# Altium schematic sheet Waveshape_LFO_v1_Controls_SCH.SchDoc
size A
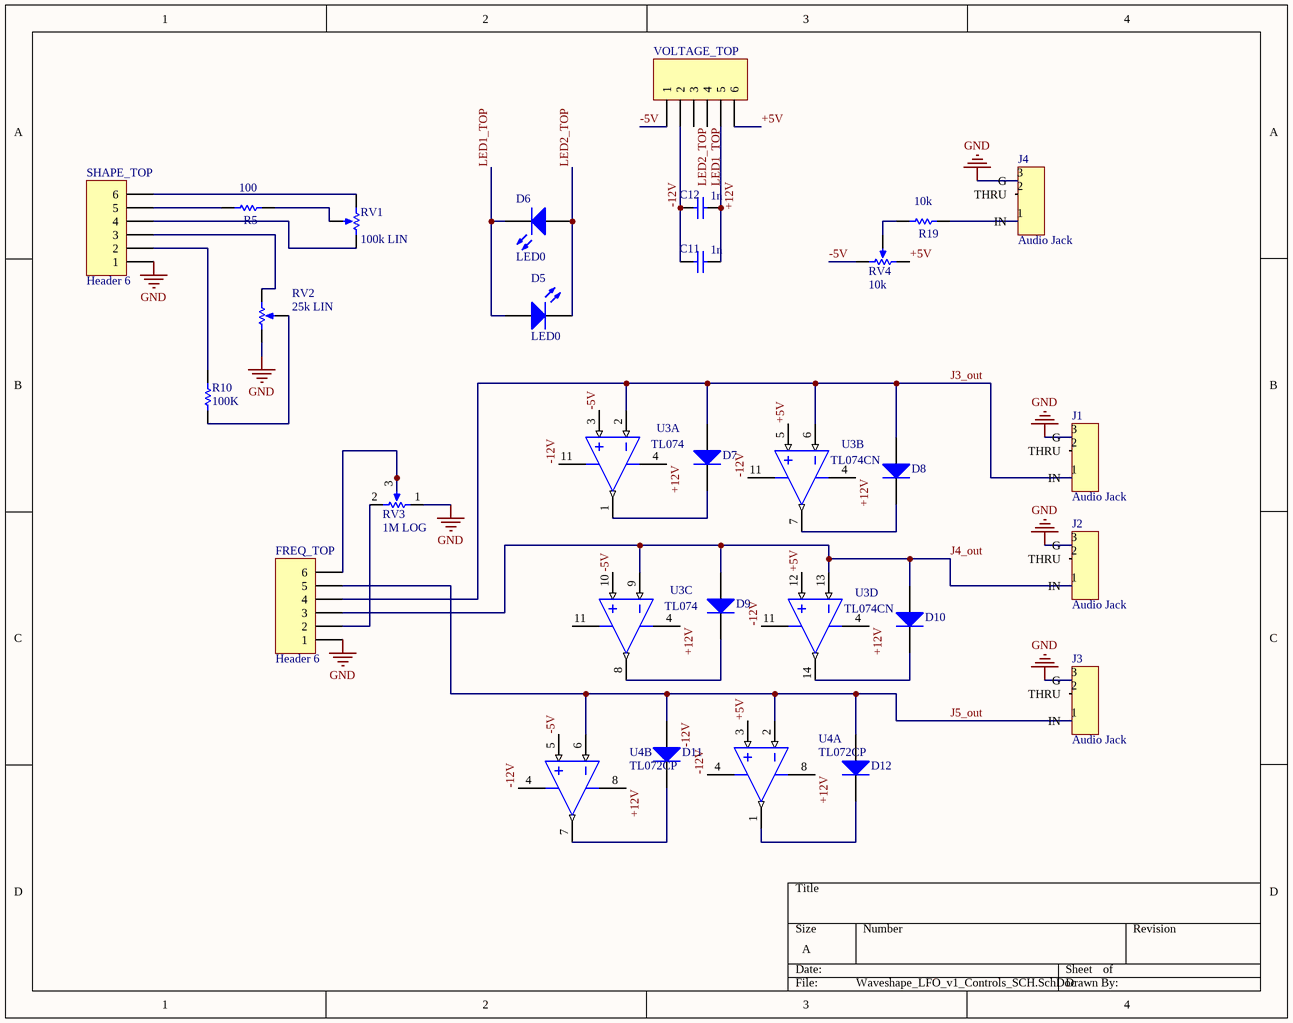
[diagram p0: Waveshape_LFO_v1_Controls_SCH.SchDoc]

## Parts
C11  value 1n  [RAD-0.3]  (hidden comment: Cap)
C12  value 1n  [RAD-0.3]  (hidden comment: Cap)
D5  LED0  [LED-1]
D6  LED0  [LED-1]
D7  Diode 1N4148  [DO-35]  (value not drawn)
D8  Diode 1N4148  [DO-35]  (value not drawn)
D9  Diode 1N4148  [DO-35]  (value not drawn)
D10  Diode 1N4148  [DO-35]  (value not drawn)
D11  Diode 1N4148  [DO-35]  (value not drawn)
D12  Diode 1N4148  [DO-35]  (value not drawn)
FREQ_TOP  Header 6  [HDR1X6]
J1  Audio Jack  [Audio Jack]
J2  Audio Jack  [Audio Jack]
J3  Audio Jack  [Audio Jack]
J4  Audio Jack  [Audio Jack]
R5  value 100  [AXIAL-0.3]
R10  value 100K  [AXIAL-0.3]
R19  value 10k  [AXIAL-0.3]
RV1  value 100k LIN  [VR5]  (hidden comment: RPot)
RV2  value 25k LIN  [VR5]  (hidden comment: j)
RV3  value 1M LOG  [VR5]  (hidden comment: RPot)
RV4  value 10k  [VR5]  (hidden comment: RPot)
SHAPE_TOP  Header 6  [HDR1X6]
U3  TL074  [N0014A]  (parts A,B,C,D of 4)
U4  TL072CP  [P0008A]  (parts A,B of 2)
VOLTAGE_TOP  Header 6  [HDR1X6]  (value not drawn)

## Nets
GND: FREQ_TOP.1 J1.3(G) J2.3(G) J3.3(G) J4.3(G) RV2.1(TOP) RV3.1(TOP) SHAPE_TOP.1
+5V: RV4.1(TOP) U3.5(IN2+) U3.12(IN4+) U4.3(IN1+) VOLTAGE_TOP.6
+12V: C11.2 C12.2 U3.4(VCC+) U4.8(VCC+) VOLTAGE_TOP.5
-5V: RV4.2(BOT) U3.3(IN1+) U3.10(IN3+) U4.5(IN2+) VOLTAGE_TOP.1
-12V: C11.1 C12.1 U3.11(VCC-) U4.4(VCC-) VOLTAGE_TOP.2
J3_out: D7.1(A) D8.1(A) FREQ_TOP.4 J1.1(IN) U3.2(IN1-) U3.6(IN2-)
J4_out: D9.1(A) D10.1(A) FREQ_TOP.3 J2.1(IN) U3.9(IN3-) U3.13(IN4-)
J5_out: D11.1(A) D12.1(A) FREQ_TOP.5 J3.1(IN) U4.2(IN1-) U4.6(IN2-)
LED1_TOP: D5.1(A) D6.2(K) VOLTAGE_TOP.4
LED2_TOP: D5.2(K) D6.1(A) VOLTAGE_TOP.3
NetD7_2: D7.2(K) U3.1(OUT1)
NetD8_2: D8.2(K) U3.7(OUT2)
NetD9_2: D9.2(K) U3.8(OUT3)
NetD10_2: D10.2(K) U3.14(OUT4)
NetD11_2: D11.2(K) U4.7(OUT2)
NetD12_2: D12.2(K) U4.1(OUT1)
NetFREQ_TOP_2: FREQ_TOP.2 RV3.2(BOT)
NetFREQ_TOP_6: FREQ_TOP.6 RV3.3(TAP)
NetJ4_1: J4.1(IN) R19.2
NetR5_1: R5.1 SHAPE_TOP.5
NetR5_2: R5.2 RV1.3(TAP)
NetR10_1: R10.1 RV2.3(TAP)
NetR10_2: R10.2 SHAPE_TOP.2
NetR19_1: R19.1 RV4.3(TAP)
NetRV1_1: RV1.1(TOP) SHAPE_TOP.6
NetRV1_2: RV1.2(BOT) SHAPE_TOP.4
NetRV2_2: RV2.2(BOT) SHAPE_TOP.3

Not connected (* = marked no-connect by the designer): J1 2(THRU); J2 2(THRU); J3 2(THRU); J4 2(THRU)

## Notes on the sheet
- Labels drawn without touching a wire or pin: -12V

## Library data of the parts
C11 C12 = Cap: Capacitor; Published: 8-Jun-2000; LatestRevisionDate: 17-Jul-2002; LatestRevisionNote: Re-released for DXP Platform.; PackageReference: RAD-0.3; Publisher: Altium Limited; PackageDescription: Radial Cap, Thru-Hole; 2 Leads; 0.3 in Pin Spacing
D5 D6 = LED0: Typical INFRARED GaAs LED; Published: 8-Jun-2000; LatestRevisionDate: 08-Jul-2005; LatestRevisionNote: Mech Layer 1 removed.; PackageReference: LED-0; Publisher: Altium Limited; PackageDescription: LED; 2 Leads
D7-D12 = Diode 1N4148: High Conductance Fast Diode; Published: 8-Jun-2000; LatestRevisionDate: 17-Jul-2002; LatestRevisionNote: Re-released for DXP Platform.; DatasheetVersion: 1997; PackageReference: DO-35; Publisher: Altium Limited; PackageDescription: Diode, Axial; Body 3.8 x 1.9 mm (LxDia. max), Lead Dia. 0.53 mm (max); Code_JEDEC: DO-204-AH; ComponentLink1Description: Manufacturer Link; ComponentLink1URL: http://www.fairchildsemi.com/; ComponentLink2Description: Datasheet; ComponentLink2URL: http://www.fairchildsemi.com/ds/1N%2F1N4148.pdf
FREQ_TOP SHAPE_TOP VOLTAGE_TOP = Header 6: Header, 6-Pin; System: Connector; LatestRevisionDate: 17-Jul-2002; LatestRevisionNote: Re-released for DXP Platform.; Publisher: Altium Limited; Parameter 1: *
R5 R10 R19 = Res1: Resistor; Published: 8-Jun-2000; LatestRevisionDate: 17-Jul-2002; LatestRevisionNote: Re-released for DXP Platform.; PackageReference: AXIAL-0.3; Publisher: Altium Limited; PackageDescription: Axial Device, Thru-Hole; 2 Leads; 0.3 in Pin Spacing
RV1-RV4 = RPot: Potentiometer; Sim Note: Enter the Resistance value and the set point into parameter fields.; Set Position: 0.5; Published: 8-Jun-2000; LatestRevisionDate: 17-Jul-2002; LatestRevisionNote: Re-released for DXP Platform.; PackageReference: VR5; Publisher: Altium Limited; PackageDescription: Variable Resistor, Thru-Hole; 3 Leads
U3 = CMP-0015-00129-2: Quad Low-Noise JFET-Input General-Purpose Operational Amplifier, 7 to 36 V, 0 to 70 degC, 14-pin DIP (N14), Pb-Free (RoHS); Manufacturer: Texas Instruments; PartNumber: TL074CN; Rating: Military; Total Supply Voltage(Max)(+5V is 5, +/-5V is 10): 36; IIB(Max)(pA): 200; Number of Channels: 4; Sub Family: General Purpose Amplifier, High Supply Voltage Amplifier (>=30V); Vio (25C)(Max)(mV): 10; Iq per channel(Max)(mA): 2.5; Total Supply Voltage(Min)(+5V is 5, +/-5V is 10): 7; Vn at 1kHz(Typ)(nV/rtHz): 18; Slew Rate(Typ)(V/us): 13; GBW(Typ)(MHz): 3; CMRR(Min)(dB): 70; DatasheetVersion: SLOS080J; ComponentLink2Description: Datasheet; ComponentLink2URL: http://www.ti.com/lit/ds/symlink/tl074.pdf; ComponentLink3URL: http://www.ti.com/lit/ml/mpdi002c/mpdi002c.pdf; PackageDescription: 14-Pin Plastic In-Line, Body 19.305 x 6.35 mm, Pitch 2.54 mm; Eco-Plan: Pb-Free (RoHS); ComponentLink1Description: Manufacturer URL; PackageReference: N0014A; ComponentLink3Description: Package Specification; Mounting Technology: Through Hole; PackageVersion: 4040049/E, 12/2002; ComponentLink1URL: http://www.ti.com/; Offset Drift(Typ)(uV/C): 18; Code_JEDEC: MS-001
U4 = CMP-0017-00950-2: Dual Low-Noise JFET-Input General-Purpose Operational Amplifier, 7 to 36 V, 0 to 70 degC, 8-pin DIP (P8), Pb-Free (RoHS); Manufacturer: Texas Instruments; Sub Family: General Purpose Amplifier, High Supply Voltage Amplifier (>=30V); Total Supply Voltage(Max)(+5V is 5, +/-5V is 10): 36; Slew Rate(Typ)(V/us): 13; Vn at 1kHz(Typ)(nV/rtHz): 18; GBW(Typ)(MHz): 3; CMRR(Min)(dB): 70; Total Supply Voltage(Min)(+5V is 5, +/-5V is 10): 7; Vio (25C)(Max)(mV): 10; Rating: Catalog; IIB(Max)(pA): 200; Iq per channel(Max)(mA): 2.5; Number of Channels: 2; Mounting Technology: Through Hole; ComponentLink3Description: Package Specification; PartNumber: TL072CP; PackageVersion: 4040082/E, 04/2010; Eco-Plan: Pb-Free (RoHS); DatasheetVersion: SLOS080J; Offset Drift(Typ)(uV/C): 18; ComponentLink3URL: http://www.ti.com/litv/pdf/mpdi001b; PackageDescription: 8-Pin Plastic In-Line, Body 9.59 x 6.35 mm, Pitch 2.54 mm; Code_JEDEC: MS-001; ComponentLink2URL: http://www.ti.com/lit/ds/symlink/tl072.pdf; ComponentLink1Description: Manufacturer URL; ComponentLink2Description: Datasheet; ComponentLink1URL: http://www.ti.com/; PackageReference: P0008A